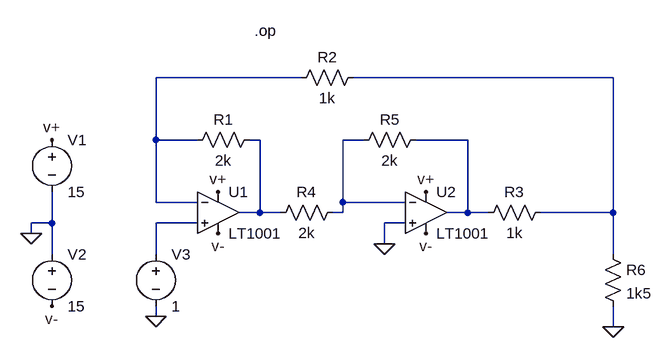
[diagram p0: schematic fuentecorriente.asc]
fuentecorriente.asc, the LTspice schematic file:
Version 4
SHEET 1 924 680
WIRE 272 -32 48 -32
WIRE 752 -32 352 -32
WIRE 48 64 48 -32
WIRE 112 64 48 64
WIRE 208 64 192 64
WIRE 368 64 336 64
WIRE 528 64 448 64
WIRE 48 160 48 64
WIRE 112 160 48 160
WIRE 336 160 336 64
WIRE 432 160 336 160
WIRE 208 176 208 64
WIRE 208 176 176 176
WIRE 240 176 208 176
WIRE 336 176 336 160
WIRE 336 176 320 176
WIRE 528 176 528 64
WIRE 528 176 496 176
WIRE 560 176 528 176
WIRE 752 176 752 -32
WIRE 752 176 640 176
WIRE -112 192 -112 144
WIRE -112 192 -144 192
WIRE 112 192 48 192
WIRE 432 192 400 192
WIRE -144 208 -144 192
WIRE 400 224 400 192
WIRE -112 240 -112 192
WIRE 48 240 48 192
WIRE 752 240 752 176
WIRE 48 336 48 320
WIRE 752 352 752 320
FLAG -144 208 0
FLAG -112 64 v+
FLAG -112 320 v-
FLAG 144 208 v-
FLAG 464 208 v-
FLAG 144 144 v+
FLAG 464 144 v+
FLAG 48 336 0
FLAG 400 224 0
FLAG 752 352 0
DATAFLAG 528 64 ""
DATAFLAG 752 176 ""
DATAFLAG 208 144 ""
SYMBOL OpAmps\\LT1001 144 112 R0
SYMATTR InstName U1
SYMBOL OpAmps\\LT1001 464 112 R0
SYMATTR InstName U2
SYMBOL voltage -112 48 R0
WINDOW 123 0 0 Left 0
WINDOW 39 0 0 Left 0
SYMATTR InstName V1
SYMATTR Value 15
SYMBOL voltage -112 224 R0
WINDOW 123 0 0 Left 0
WINDOW 39 0 0 Left 0
SYMATTR InstName V2
SYMATTR Value 15
SYMBOL res 208 48 R90
WINDOW 0 0 56 VBottom 2
WINDOW 3 32 56 VTop 2
SYMATTR InstName R1
SYMATTR Value 2k
SYMBOL res 368 -48 R90
WINDOW 0 0 56 VBottom 2
WINDOW 3 32 56 VTop 2
SYMATTR InstName R2
SYMATTR Value 1k
SYMBOL res 656 160 R90
WINDOW 0 0 56 VBottom 2
WINDOW 3 32 56 VTop 2
SYMATTR InstName R3
SYMATTR Value 1k
SYMBOL res 336 160 R90
WINDOW 0 0 56 VBottom 2
WINDOW 3 32 56 VTop 2
SYMATTR InstName R4
SYMATTR Value 2k
SYMBOL res 464 48 R90
WINDOW 0 0 56 VBottom 2
WINDOW 3 32 56 VTop 2
SYMATTR InstName R5
SYMATTR Value 2k
SYMBOL voltage 48 224 R0
WINDOW 123 0 0 Left 0
WINDOW 39 0 0 Left 0
SYMATTR InstName V3
SYMATTR Value 1
SYMBOL res 736 224 R0
SYMATTR InstName R6
SYMATTR Value 1k5
TEXT 200 -104 Left 2 !.op

The netlist it stands for:
* fuentecorriente.asc
XU1 N006 N001 v+ v- N003 LT1001  ; pins In+ In- V+ V- OUT
XU2 0 N004 v+ v- N005 LT1001  ; pins In+ In- V+ V- OUT
V1 v+ 0 15
V2 0 v- 15
R1 N003 N001 2k
R2 N002 N001 1k
R3 N002 N005 1k
R4 N004 N003 2k
R5 N005 N004 2k
V3 N006 0 1
R6 N002 0 1k5
.op
.lib LTC.lib
.backanno
.end